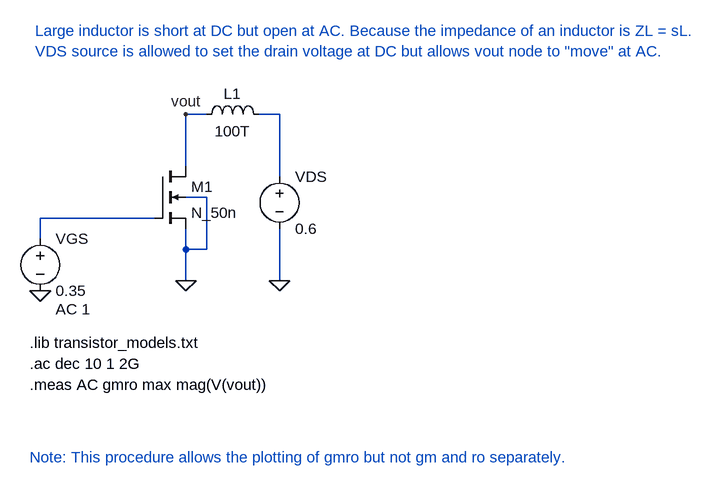
[diagram p0: schematic lab05_gmro_extract.asc]
lab05_gmro_extract.asc, the LTspice schematic file:
Version 4
SHEET 1 1100 680
WIRE -80 -80 -112 -80
WIRE 32 -80 0 -80
WIRE -112 0 -112 -80
WIRE 32 16 32 -80
WIRE -80 48 -112 48
WIRE -160 80 -336 80
WIRE -336 112 -336 80
WIRE -112 128 -112 96
WIRE -80 128 -80 48
WIRE -80 128 -112 128
WIRE -112 176 -112 128
WIRE 32 176 32 96
FLAG -112 176 0
FLAG 32 176 0
FLAG -336 192 0
FLAG -112 -80 vout
SYMBOL voltage 32 0 R0
WINDOW 123 0 0 Left 0
WINDOW 39 0 0 Left 0
SYMATTR InstName VDS
SYMATTR Value 0.6
SYMBOL voltage -336 96 R0
WINDOW 123 24 124 Left 2
WINDOW 39 0 0 Left 0
SYMATTR Value2 AC 1
SYMATTR InstName VGS
SYMATTR Value 0.35
SYMBOL nmos4 -160 0 R0
SYMATTR InstName M1
SYMATTR Value N_50n
SYMATTR Value2 l=1u w=10u
SYMBOL ind -96 -64 R270
WINDOW 0 32 56 VTop 2
WINDOW 3 5 56 VBottom 2
SYMATTR InstName L1
SYMATTR Value 100T
TEXT -352 272 Left 2 !.lib transistor_models.txt
TEXT -352 304 Left 2 !.ac dec 10 1 2G
TEXT -352 336 Left 2 !.meas AC gmro max mag(V(vout))
TEXT -344 -208 Left 2 ;Large inductor is short at DC but open at AC. Because the impedance of an inductor is ZL = sL.\nVDS source is allowed to set the drain voltage at DC but allows vout node to "move" at AC.
TEXT -352 448 Left 2 ;Note: This procedure allows the plotting of gmro but not gm and ro separately.

The netlist it stands for:
* lab05_gmro_extract.asc
VDS N001 0 0.6
VGS N002 0 0.35 AC 1
M1 vout N002 0 0 N_50n l=1u w=10u
L1 vout N001 100T
.model NMOS NMOS
.model PMOS PMOS
.lib standard.mos
.lib transistor_models.txt
.ac dec 10 1 2G
.meas AC gmro max mag(V(vout))
* Large inductor is short at DC but open at AC. Because the impedance of an inductor is ZL = sL.
* VDS source is allowed to set the drain voltage at DC but allows vout node to "move" at AC.
* Note: This procedure allows the plotting of gmro but not gm and ro separately.
.backanno
.end